# Altium schematic sheet 26P2.SchDoc
size A4
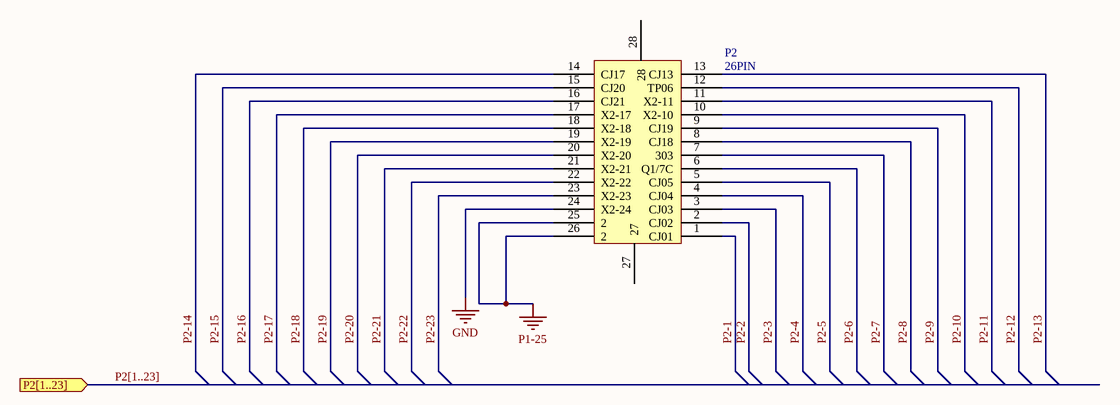
[diagram p0: 26P2.SchDoc]

## Parts
P2  26PIN  [2*13]

## Ports
P2[1..23]

## Nets
GND: P2.24(X2-24)
P1-25: P2.25(2) P2.26(2)
P2-1: P2.1(CJ01)
P2-2: P2.2(CJ02)
P2-3: P2.3(CJ03)
P2-4: P2.4(CJ04)
P2-5: P2.5(CJ05)
P2-6: P2.6(Q1/7C)
P2-7: P2.7(303)
P2-8: P2.8(CJ18)
P2-9: P2.9(CJ19)
P2-10: P2.10(X2-10)
P2-11: P2.11(X2-11)
P2-12: P2.12(TP06)
P2-13: P2.13(CJ13)
P2-14: P2.14(CJ17)
P2-15: P2.15(CJ20)
P2-16: P2.16(CJ21)
P2-17: P2.17(X2-17)
P2-18: P2.18(X2-18)
P2-19: P2.19(X2-19)
P2-20: P2.20(X2-20)
P2-21: P2.21(X2-21)
P2-22: P2.22(X2-22)
P2-23: P2.23(X2-23)

Not connected (* = marked no-connect by the designer): P2 27 28

## Buses and harness runs
bus P2[1..23] = port P2[1..23]

## Library data of the parts
P2 = Component_1